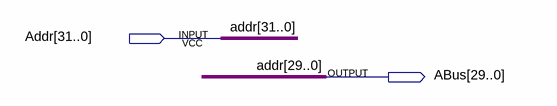
[diagram p0: schematic sheet]
// Quartus schematic DBIUA.bdf as structural Verilog: 0 symbols, 2 pins
module DBIUA (
  input  [31:0] Addr,
  output [29:0] ABus
);


  assign ABus = Addr[29:0];
endmodule
